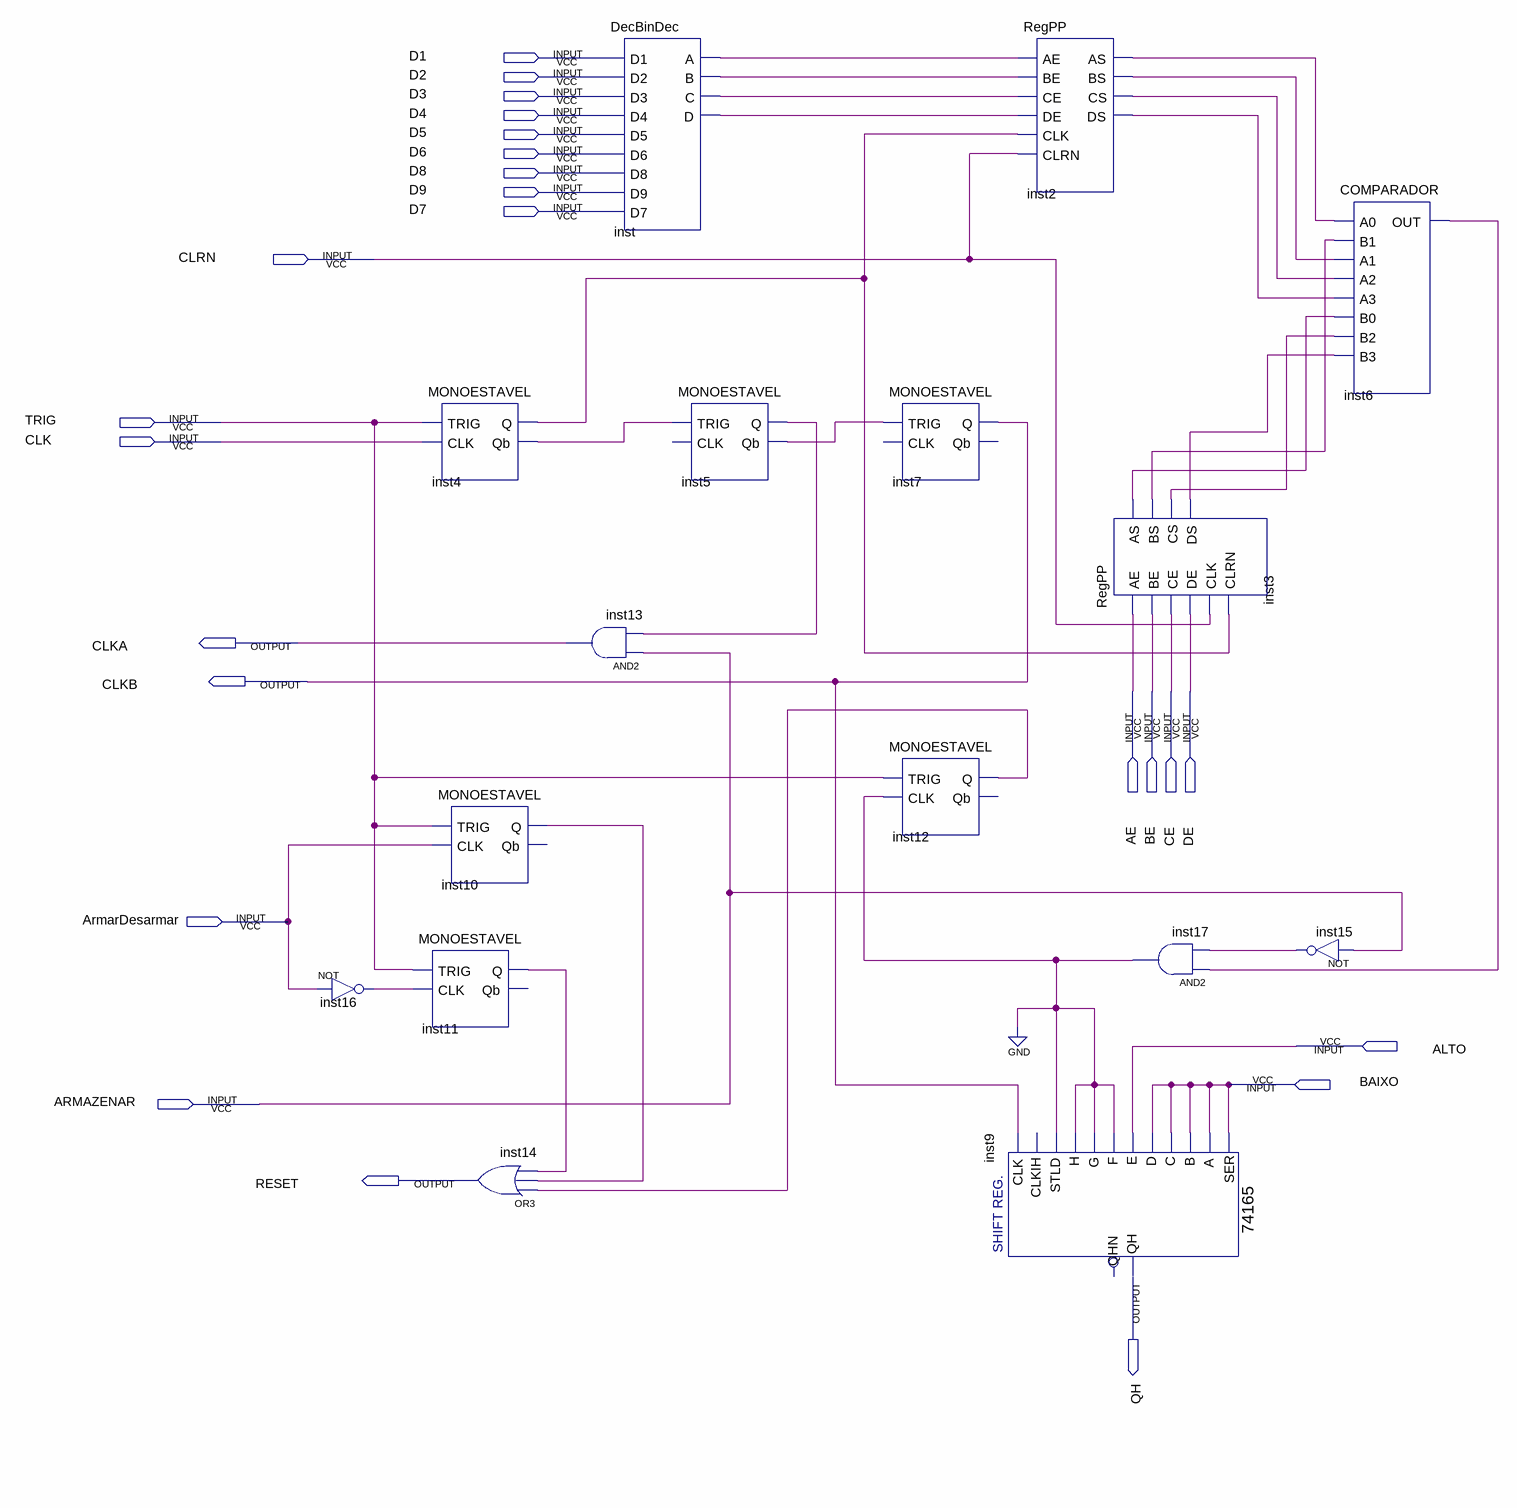
[diagram p0: schematic sheet]
// Quartus schematic LogicaSeguranca.bdf as structural Verilog: 16 symbols, 24 pins
module LogicaSeguranca (
  input  D1,
  input  D2,
  input  D3,
  input  D4,
  input  D5,
  input  D6,
  input  D8,
  input  D9,
  input  D7,
  input  CLRN,
  input  TRIG,
  input  CLK,
  input  AE,
  input  BE,
  input  CE,
  input  DE,
  input  ArmarDesarmar,
  input  ALTO,
  input  BAIXO,
  input  ARMAZENAR,
  output CLKA,
  output CLKB,
  output RESET,
  output QH
);

  wire inst2_as, inst2_bs, inst2_cs, inst2_ds, inst3_as, inst3_bs, inst3_cs, inst3_ds, inst4_q, inst4_qb,
       inst5_q, inst5_qb, inst6_out, inst10_q, inst11_q, inst12_q, inst15_out, inst16_out, inst17_out,
       inst_a, inst_b, inst_c, inst_d;

  not inst16 (inst16_out, ArmarDesarmar);
  MONOESTAVEL inst4 (.TRIG(TRIG), .CLK(CLK), .Q(inst4_q), .Qb(inst4_qb));
  MONOESTAVEL inst10 (.TRIG(TRIG), .CLK(ArmarDesarmar), .Q(inst10_q));  // open: Qb
  MONOESTAVEL inst11 (.TRIG(TRIG), .CLK(inst16_out), .Q(inst11_q));  // open: Qb
  or inst14 (RESET, inst12_q, inst10_q, inst11_q);
  and inst13 (CLKA, ARMAZENAR, inst5_q);
  DecBinDec inst (
    .D1(D1), .D2(D2), .D3(D3), .D4(D4), .D5(D5), .D6(D6), .D8(D8), .D9(D9), .D7(D7), .A(inst_a), .B(inst_b),
    .C(inst_c), .D(inst_d));
  MONOESTAVEL inst5 (.TRIG(inst4_qb), .Q(inst5_q), .Qb(inst5_qb));  // open: CLK
  MONOESTAVEL inst7 (.TRIG(inst5_qb), .Q(CLKB));  // open: CLK, Qb
  MONOESTAVEL inst12 (.TRIG(TRIG), .CLK(inst17_out), .Q(inst12_q));  // open: Qb
  RegPP inst2 (
    .AE(inst_a), .BE(inst_b), .CE(inst_c), .DE(inst_d), .CLK(inst4_q), .CLRN(CLRN), .AS(inst2_as),
    .BS(inst2_bs), .CS(inst2_cs), .DS(inst2_ds));
  \74165  inst9 (
    .D(BAIXO), .C(BAIXO), .B(BAIXO), .G(inst17_out), .H(inst17_out), .A(BAIXO), .E(ALTO), .F(inst17_out),
    .CLK(CLKB), .STLD(inst17_out), .SER(BAIXO), .QH(QH));  // open: CLKIH, QHN
  RegPP inst3 (
    .AE(AE), .BE(BE), .CE(CE), .DE(DE), .CLK(CLRN), .CLRN(inst4_q), .AS(inst3_as), .BS(inst3_bs),
    .CS(inst3_cs), .DS(inst3_ds));
  and inst17 (inst17_out, inst6_out, inst15_out);
  COMPARADOR inst6 (
    .A0(inst2_as), .B1(inst3_bs), .A1(inst2_bs), .A2(inst2_cs), .A3(inst2_ds), .B0(inst3_as), .B2(inst3_cs),
    .B3(inst3_ds), .OUT(inst6_out));
  not inst15 (inst15_out, ARMAZENAR);
  // also tied to GND on the sheet: inst17_out
endmodule
